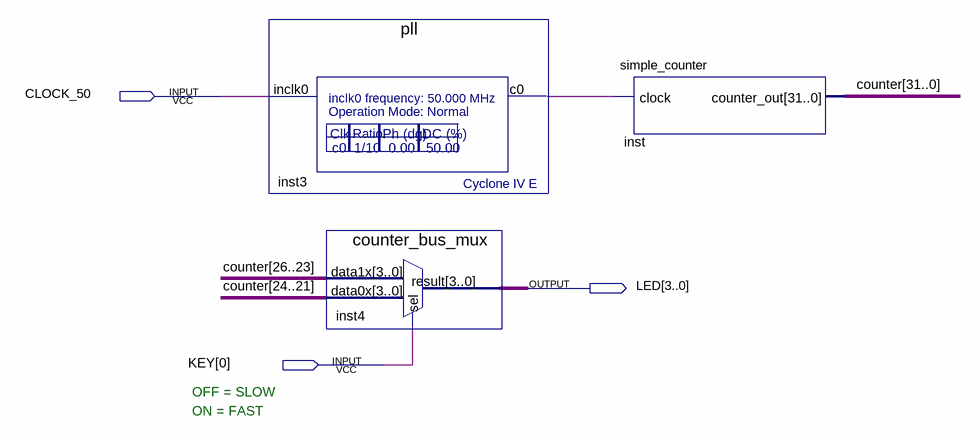
[diagram p0: schematic sheet]
// Quartus schematic main.bdf as structural Verilog: 3 symbols, 3 pins
module main (
  input  CLOCK_50,
  input  [0:0] KEY,
  output [3:0] LED
);

  wire inst3_c0;
  wire [31:0] counter;

  pll inst3 (.inclk0(CLOCK_50), .c0(inst3_c0));
  counter_bus_mux inst4 (.data1x(counter[26:23]), .data0x(counter[24:21]), .sel(KEY[0]), .result(LED));
  simple_counter inst (.clock(inst3_c0), .counter_out(counter));

  // Notes on the sheet:
  //   OFF = SLOW
  //   ON = FAST
endmodule
